# EAGLE design remote control (EAGLE 8.0.0)
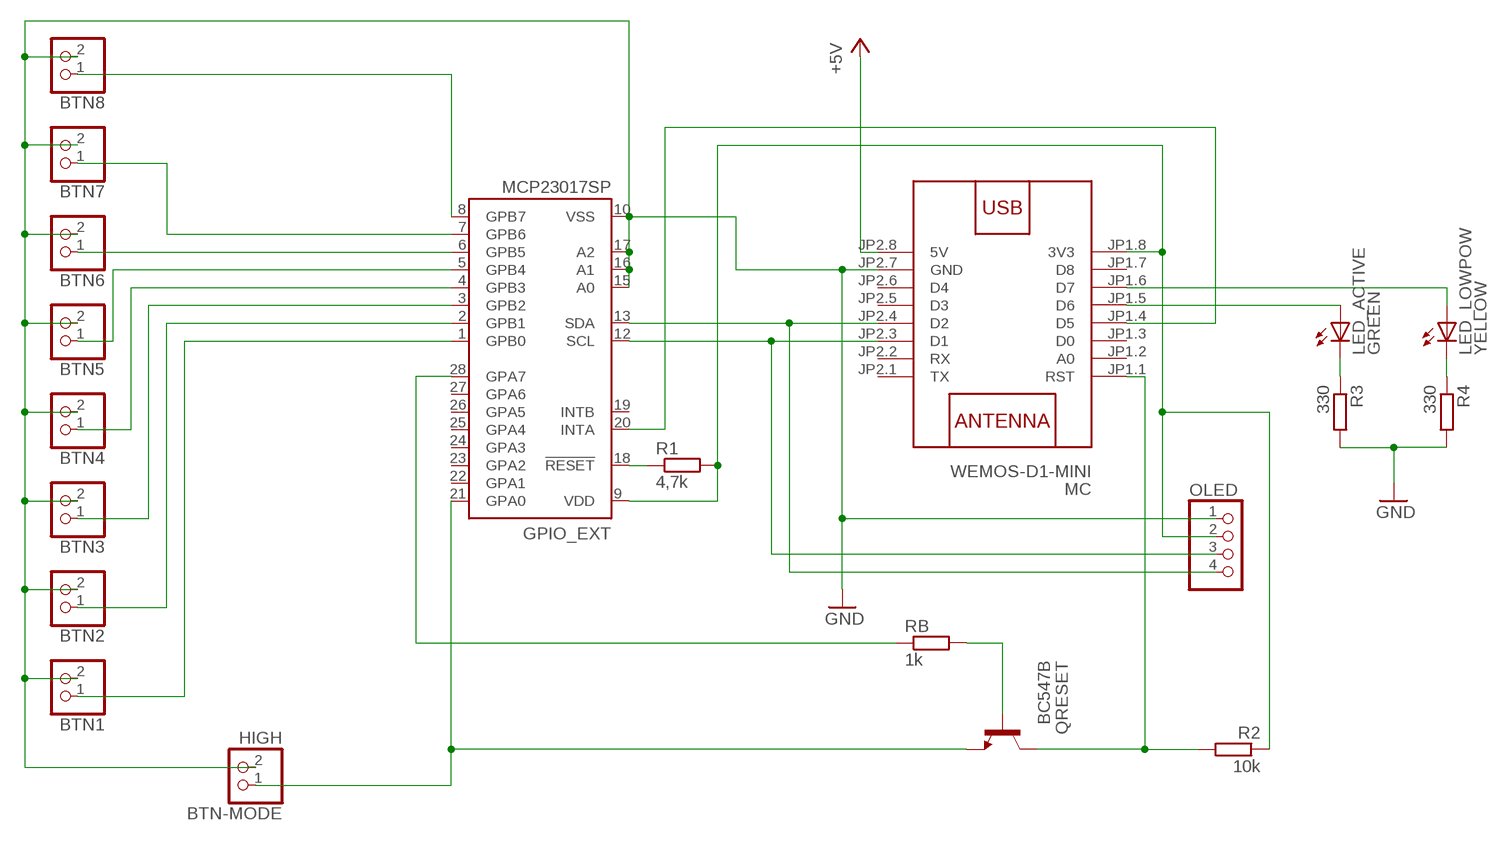
[diagram p0: schematic, sheet 1]

## Parts
BTN1  HIGH  PINHD-1X2  [1X02]
BTN2  HIGH  PINHD-1X2  [1X02]
BTN3  PINHD-1X2  [1X02]
BTN4  PINHD-1X2  [1X02]
BTN5  PINHD-1X2  [1X02]
BTN6  PINHD-1X2  [1X02]
BTN7  PINHD-1X2  [1X02]
BTN8  PINHD-1X2  [1X02]
BTN-MODE  HIGH  PINHD-1X2  [1X02]
GPIO_EXT  MCP23017SP  [DIL28-3]
LED_ACTIVE  GREEN  LED3MM  [LED3MM]
LED_LOWPOW  YELLOW  LED3MM  [LED3MM]
MC  WEMOS-D1-MINI  [WEMOS-D1-MINI]
OLED  PINHD-1X4  [1X04]
QRESET  BC547B  [TO92]
R1  4,7k  R-EU_0204/5  [0204/5]
R2  10k  R-EU_0204/5  [0204/5]
R3  330  R-EU_0204/5  [0204/5]
R4  330  R-EU_0204/5  [0204/5]
RB  1k  R-EU_0204/5  [0204/5]

## Nets
+5V: MC.JP2.8(5V)
GND: BTN1.2 BTN2.2 BTN3.2 BTN4.2 BTN5.2 BTN6.2 BTN7.2 BTN8.2 BTN-MODE.2 GPIO_EXT.10(VSS) GPIO_EXT.15(A0) GPIO_EXT.16(A1) GPIO_EXT.17(A2) MC.JP2.7(GND) OLED.1 R3.2 R4.2
N$1: BTN-MODE.1 GPIO_EXT.21(GPA0) QRESET.1(E)
N$2: GPIO_EXT.20(INTA) MC.JP1.4(D5)
N$3: MC.JP1.1(RST) QRESET.3(C) R2.2
N$4: GPIO_EXT.28(GPA7) RB.1
N$5: QRESET.2(B) RB.2
N$6: LED_ACTIVE.A MC.JP1.5(D6)
N$7: LED_ACTIVE.K(C) R3.1
N$8: LED_LOWPOW.K(C) R4.1
N$9: LED_LOWPOW.A MC.JP1.6(D7)
PIN1: BTN1.1 GPIO_EXT.1(GPB0)
PIN2: BTN2.1 GPIO_EXT.2(GPB1)
PIN3: BTN3.1 GPIO_EXT.3(GPB2)
PIN4: BTN4.1 GPIO_EXT.4(GPB3)
PIN5: BTN5.1 GPIO_EXT.5(GPB4)
PIN6: BTN6.1 GPIO_EXT.6(GPB5)
PIN7: BTN7.1 GPIO_EXT.7(GPB6)
PIN8: BTN8.1 GPIO_EXT.8(GPB7)
RST_MCP: GPIO_EXT.18(!RESET) R1.1
SCL: GPIO_EXT.12(SCL) MC.JP2.3(D1) OLED.3
SDA: GPIO_EXT.13(SDA) MC.JP2.4(D2) OLED.4
VDD: GPIO_EXT.9(VDD) MC.JP1.8(3V3) OLED.2 R1.2 R2.1
Unconnected: GPIO_EXT.19(INTB) GPIO_EXT.22(GPA1) GPIO_EXT.23(GPA2) GPIO_EXT.24(GPA3) GPIO_EXT.25(GPA4) GPIO_EXT.26(GPA5) GPIO_EXT.27(GPA6) MC.JP1.2(A0) MC.JP1.3(D0) MC.JP1.7(D8) MC.JP2.1(TX) MC.JP2.2(RX) MC.JP2.5(D3) MC.JP2.6(D4)

## Library data of the parts
BTN1-BTN8 BTN-MODE = pinhead:PINHD-1X2: PIN HEADER
GPIO_EXT = microchip:MCP23017: http://ww1.microchip.com/downloads/en/DeviceDoc/21952a.pdf Source: http://ww1.microchip.com/downloads/en/DeviceDoc/21952a.pdf; MF: MICROCHIP; MPN: MCP23017-E/SP; OC_FARNELL: 1332088; OC_NEWARK: 31K2959
LED_ACTIVE LED_LOWPOW = led:LED: LED OSRAM: - CHIPLED LG R971, LG N971, LY N971, LG Q971, LY Q971, LO R971, LY R971 LH N974, LH R974 LS Q976, LO Q976, LY Q976 LO Q996 - Hyper CHIPLED LW Q18S LB Q993, LB Q99A, LB R99A - SideLED LS A670, LO A670, LY A670, LG A670, LP A670 LB A673, LV A673, LT A673, LW A673 LH A674 LY A675 LS A676, LA A676, LO A676, LY A676, LW A676 LS A679, LY A679, LG A679 - Hyper Micro SIDELED® LS Y876, LA Y876, LO Y876, LY Y876 LT Y87S - SmartLED LW L88C, LW L88S LB L89C, LB L89S, LG L890 LS L89K, LO L89K, LY L89K LS L896, LA L896, LO L896, LY L896 - TOPLED LS T670, LO T670, LY T670, LG T670, LP T670 LSG T670, LSP T670, LSY T670, LOP T670, LYG T670 LG T671, LOG T671, LSG T671 LB T673, LV T673, LT T673, LW T673 LH T674 LS T676, LA T676, LO T676, LY T676, LB T676, LH T676, LSB T676, LW T676 LB T67C, LV T67C, LT T67C, LS T67K, LO T67K, LY T67K, LW E67C LS E67B, LA E67B, LO E67B, LY E67B, LB E67C, LV E67C, LT E67C LW T67C LS T679, LY T679, LG T679 LS T770, LO T770, LY T770, LG T770, LP T770 LB T773, LV T773, LT T773, LW T773 LH T774 LS E675, LA E675, LY E675, LS T675 LS T776, LA T776, LO T776, LY T776, LB T776 LHGB T686 LT T68C, LB T68C - Hyper Mini TOPLED® LB M676 - Mini TOPLED Santana® LG M470 LS M47K, LO M47K, LY M47K Source: http://www.osram.convergy.de LUXEON: - LUMILED® LXK2-PW12-R00, LXK2-PW12-S00, LXK2-PW14-U00, LXK2-PW14-V00 LXK2-PM12-R00, LXK2-PM12-S00, LXK2-PM14-U00 LXK2-PE12-Q00, LXK2-PE12-R00, LXK2-PE12-S00, LXK2-PE14-T00, LXK2-PE14-U00 LXK2-PB12-K00, LXK2-PB12-L00, LXK2-PB12-M00, LXK2-PB14-N00, LXK2-PB14-P00, LXK2-PB14-Q00 LXK2-PR12-L00, LXK2-PR12-M00, LXK2-PR14-Q00, LXK2-PR14-R00 LXK2-PD12-Q00, LXK2-PD12-R00, LXK2-PD12-S00 LXK2-PH12-R00, LXK2-PH12-S00 LXK2-PL12-P00, LXK2-PL12-Q00, LXK2-PL12-R00 Source: www.luxeon.com KINGBRIGHT: KA-3528ASYC Source: www.kingbright.com
MC = diy-modules:WEMOS-D1-MINI: WEMOS D1 mini: Mini Wi-Fi Board based on ESP-8266 device More details can be found here: https://www.wemos.cc/product/d1-mini.html Click here to find device on ebay.com <http://www.ebay.com/sch/wemos+d1+mini+nodemcu>
OLED = pinhead:PINHD-1X4: PIN HEADER
QRESET = transistor-npn:BC547*: NPN Transistor
R1-R4 RB = resistor:R-EU_: RESISTOR, European symbol

## Board
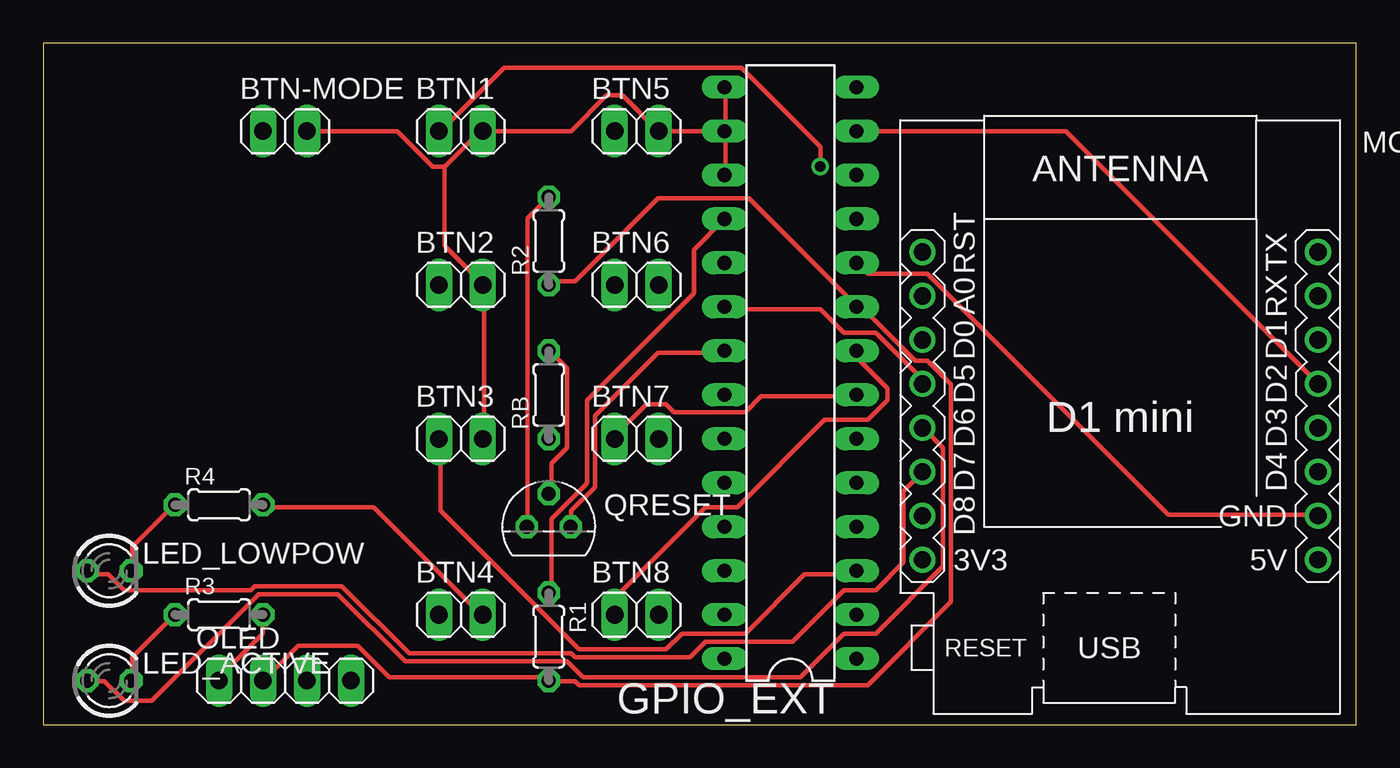
[diagram p1: board, top side]
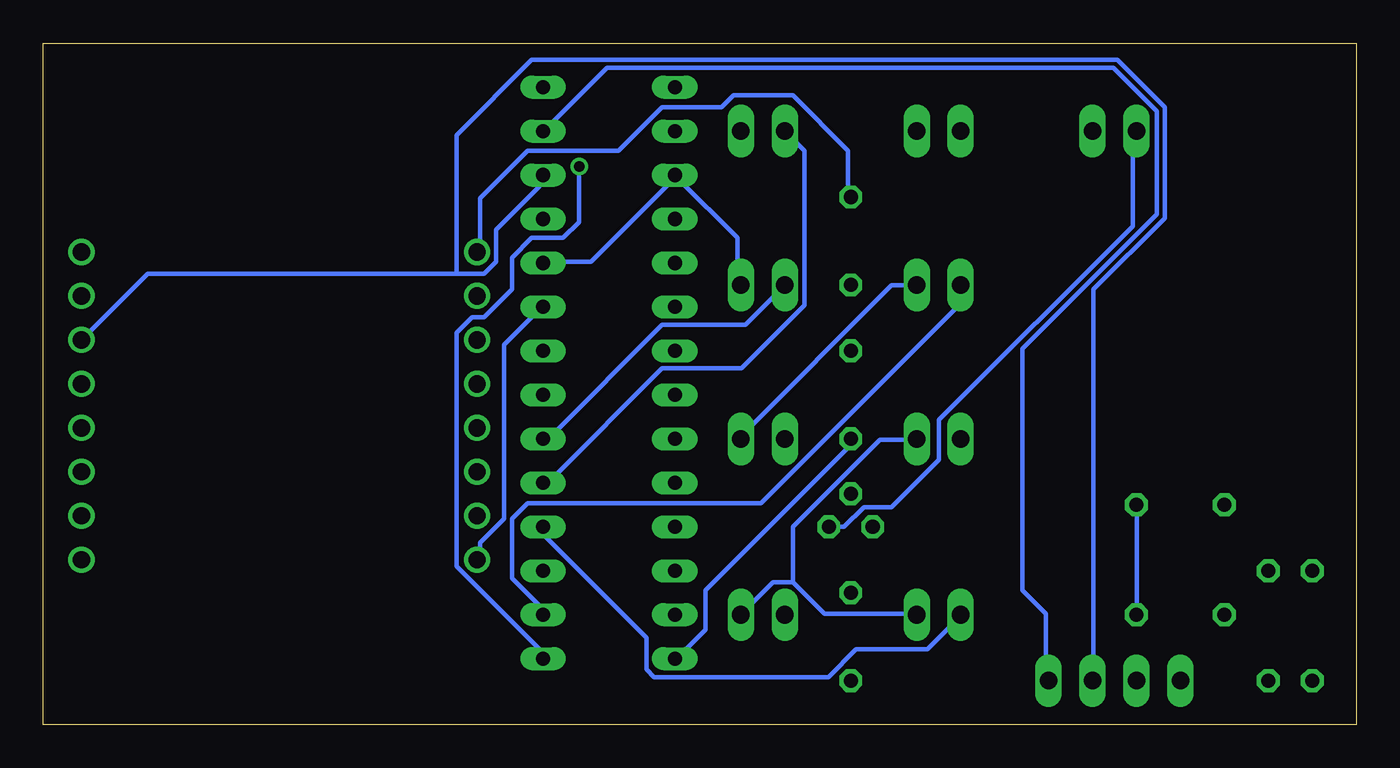
[diagram p2: board, bottom side, seen from below]

Size 75.87 x 39.36 mm. Coordinates in mm from the lower left corner, seen from the top.
Outline: 0,0 75.87,0 75.87,39.36 0,39.36 0,0
Copper layers (1*16): Top 0.035mm / dielectric 1.5mm / Bottom 0.035mm
Design rules "default": minimum track width 10mil, minimum drill 24mil, track to track 8mil, track to pad 8mil, pad to pad 8mil, via to via 8mil, smd to smd 8mil, copper to edge 40mil, drill to drill 8mil, minimum pad ring 10mil, minimum via ring 8mil, stop-mask expansion 4mil, vias tented up to drill 0mil, thermal gap 10mil

### Footprints (pad centres in the part's own frame; a part is rotated, then mirrored left to right if it is on the bottom)
1X02 = drill 1.016 long: 1 -1.27,0; 2 1.27,0
DIL28-3 = drill 0.813 long: 1 -16.51,-3.81; 2 -13.97,-3.81; 3 -11.43,-3.81; 4 -8.89,-3.81; 5 -6.35,-3.81; 6 -3.81,-3.81; 7 -1.27,-3.81; 8 1.27,-3.81; 9 3.81,-3.81; 10 6.35,-3.81; 11 8.89,-3.81; 12 11.43,-3.81; 13 13.97,-3.81; 14 16.51,-3.81; 15 16.51,3.81; 16 13.97,3.81; 17 11.43,3.81; 18 8.89,3.81; 19 6.35,3.81; 20 3.81,3.81; 21 1.27,3.81; 22 -1.27,3.81; 23 -3.81,3.81; 24 -6.35,3.81; 25 -8.89,3.81; 26 -11.43,3.81; 27 -13.97,3.81; 28 -16.51,3.81
LED3MM = drill 0.813 octagon: A -1.27,0; K 1.27,0
WEMOS-D1-MINI = drill 1: JP1.1 -11.43,9.525; JP1.2 -11.43,6.985; JP1.3 -11.43,4.445; JP1.4 -11.43,1.905; JP1.5 -11.43,-0.635; JP1.6 -11.43,-3.175; JP1.7 -11.43,-5.715; JP1.8 -11.43,-8.255; JP2.1 11.43,9.525; JP2.2 11.43,6.985; JP2.3 11.43,4.445; JP2.4 11.43,1.905; JP2.5 11.43,-0.635; JP2.6 11.43,-3.175; JP2.7 11.43,-5.715; JP2.8 11.43,-8.255
1X04 = drill 1.016 long: 1 -3.81,0; 2 -1.27,0; 3 1.27,0; 4 3.81,0
TO92 = drill 0.813 octagon: 1 1.27,0; 2 0,1.905; 3 -1.27,0
0204/5 = drill 0.813 octagon: 1 -2.54,0; 2 2.54,0

### Placement (x,y rotation side)
BTN1  24.13,34.29 0 top
BTN2  24.13,25.4 0 top
BTN3  24.13,16.51 0 top
BTN4  24.13,6.35 0 top
BTN5  34.29,34.29 0 top
BTN6  34.29,25.4 0 top
BTN7  34.29,16.51 0 top
BTN8  34.29,6.35 0 top
BTN-MODE  13.97,34.29 0 top
GPIO_EXT  43.18,20.32 90 top
LED_ACTIVE  3.81,2.54 0 top
LED_LOWPOW  3.81,8.89 0 top
MC  62.23,17.78 0 top
OLED  13.97,2.54 0 top
QRESET  29.21,11.43 0 top
R1  29.21,5.08 270 top
R2  29.21,27.94 90 top
R3  10.16,6.35 0 top
R4  10.16,12.7 0 top
RB  29.21,19.05 90 top

### Tracks (layer width: path | path; a pad name or v marks a point on that pad's centre or on a via)
GND
  Top 0.254: R3.2 12.68,6.17 12.68,5.26 10.16,2.74 OLED.1 | BTN-MODE.2 20.45,34.29 22.5,32.23 23.19,32.23 | 23.19,32.23 25.25,34.29 BTN1.2 30.5,34.29 32.56,36.35 33.48,36.35 35.53,34.29 BTN5.2 GPIO_EXT.16 39.42,34.29 | BTN3.2 25.48,16.69 25.48,25.38 BTN2.2 25.25,25.6 23.19,27.66 23.19,32.23 | R4.2 12.9,12.57 19.07,12.57 25.25,6.4 BTN4.2 | 39.42,34.29 39.42,31.77 GPIO_EXT.17 | 39.42,34.29 39.42,36.8 GPIO_EXT.15 | MC.JP2.7 73.48,12.12 65.02,12.12 51.08,26.06 47.65,26.06 47.19,26.52 GPIO_EXT.10
  Bottom 0.254: R4.2 12.68,12.57 12.68,6.4 R3.2 | 32.56,8.23 30.73,6.4 25.48,6.4 BTN4.2 | 32.56,8.23 33.71,8.23 35.53,6.4 BTN8.2 | BTN7.2 35.53,16.69 26.85,25.38 25.48,25.38 BTN2.2 | 32.56,8.23 32.56,11.43 27.53,16.46 25.48,16.46 BTN3.2 | GPIO_EXT.10 46.97,26.75 44.22,26.75 39.42,31.55 GPIO_EXT.17 39.19,31.55 35.76,28.12 35.76,25.6 BTN6.2
N$1
  Top 0.254: QRESET.1 30.5,11.43 30.5,12.34 31.88,13.72 31.88,17.83 35.53,21.49 39.19,21.49 GPIO_EXT.21
  Bottom 0.254: QRESET.1 29.59,11.43 28.45,12.57 26.85,12.57 24.11,15.32 24.11,17.6 12.9,28.8 12.9,34.29 BTN-MODE.1
N$2
  Top 0.254: GPIO_EXT.20 39.42,24 44.91,24 46.28,22.63 48.11,22.63 50.85,19.89 MC.JP1.4
N$3
  Top 0.254: R2.2 27.99,29.26 27.99,11.43 QRESET.3
  Bottom 0.254: MC.JP1.1 50.62,27.43 50.62,30.4 47.88,33.15 42.62,33.15 40.11,35.66 36.68,35.66 35.99,36.35 32.56,36.35 29.36,33.15 29.36,30.63 R2.2
N$4
  Bottom 0.254: RB.1 29.36,16.46 29.36,16 37.59,7.77 37.59,5.49 39.19,3.89 GPIO_EXT.28
N$5
  Top 0.254: QRESET.2 29.36,13.49 29.36,15.09 30.28,16 30.28,20.57 29.36,21.49 RB.2
N$6
  Top 0.254: LED_ACTIVE.A 2.62,2.52 3.53,2.52 4.67,1.37 6.27,1.37 12.45,7.54 17.02,7.54 20.9,3.66 30.28,3.66 31.19,2.74 43.76,2.74 46.28,5.26 48.11,5.26 51.99,9.14 51.99,16 50.85,17.14 MC.JP1.5
N$7
  Top 0.254: LED_ACTIVE.K 5.13,2.74 5.13,3.89 7.42,6.17 R3.1
N$8
  Top 0.254: LED_LOWPOW.K 5.13,8.91 5.13,10.29 7.42,12.57 R4.1
N$9
  Top 0.254: LED_LOWPOW.A 2.62,8.69 3.76,8.69 4.67,7.77 11.99,7.77 12.22,8 17.25,8 21.13,4.12 30.5,4.12 30.73,3.89 37.36,3.89 38.28,4.8 43.31,4.8 46.28,7.77 48.11,7.77 49.71,9.37 49.71,13.49 50.62,14.4 MC.JP1.6
PIN1  (via drill 0.61)
  Top 0.254: v44.91,32.23 44.91,33.38 40.34,37.95 26.62,37.95 22.96,34.29 BTN1.1
  Bottom 0.254: v44.91,32.23 44.91,29.03 45.82,28.12 47.65,28.12 48.79,26.98 48.79,25.15 50.39,23.55 51.08,23.55 51.99,22.63 51.99,9.14 47.19,4.34 47.19,3.89 GPIO_EXT.1
PIN2
  Bottom 0.254: GPIO_EXT.2 47.19,6.4 47.19,6.86 48.79,8.46 48.79,11.89 47.88,12.8 34.39,12.8 22.96,24.23 22.96,25.38 BTN2.1
PIN3
  Top 0.254: GPIO_EXT.3 46.97,8.69 43.99,8.69 40.56,5.26 36.91,5.26 35.99,4.34 30.96,4.34 22.96,12.34 22.96,16.46 BTN3.1
PIN4
  Bottom 0.254: GPIO_EXT.4 46.97,11.43 46.97,10.97 41.02,5.03 41.02,3.2 40.56,2.74 30.5,2.74 28.91,4.34 24.79,4.34 22.96,6.17 BTN4.1
PIN5
  Bottom 0.254: BTN5.1 31.88,33.15 31.88,24.23 35.53,20.57 40.11,20.57 46.51,14.17 46.97,14.17 GPIO_EXT.5
PIN6
  Bottom 0.254: GPIO_EXT.6 46.97,16.69 46.51,16.69 40.11,23.09 35.31,23.09 33.02,25.38 BTN6.1
PIN7
  Top 0.254: GPIO_EXT.7 46.97,18.97 41.48,18.97 40.56,18.06 36.45,18.06 35.99,18.52 34.85,18.52 33.02,16.69 BTN7.1
PIN8
  Top 0.254: BTN8.1 33.02,7.32 38.28,12.57 40.11,12.57 45.14,17.6 47.65,17.6 48.79,18.75 48.79,19.43 47.19,21.03 47.19,21.49 GPIO_EXT.8
RST_MCP
  Top 0.254: GPIO_EXT.18 37.59,27.43 37.59,24.92 31.42,18.75 31.42,13.95 29.36,11.89 29.36,7.77 R1.1
SCL
  Bottom 0.254: 51.99,26.06 69.83,26.06 MC.JP2.3 | 51.99,26.06 50.39,26.06 49.71,26.75 49.71,28.57 47.19,31.09 47.19,31.55 GPIO_EXT.12 | 51.99,26.06 51.99,34.06 47.65,38.41 13.82,38.41 11.07,35.66 11.07,29.26 15.19,25.15 15.19,2.74 OLED.3
SDA
  Top 0.254: GPIO_EXT.13 59.08,34.29 73.48,19.89 MC.JP2.4
  Bottom 0.254: OLED.4 17.93,2.74 17.93,6.4 19.3,7.77 19.3,21.72 11.53,29.49 11.53,35.43 14.05,37.95 43.31,37.95 46.97,34.29 GPIO_EXT.13
VDD
  Top 0.254: OLED.2 14.73,4.57 18.16,4.57 19.99,2.74 29.13,2.74 R1.2 29.36,2.52 30.73,2.52 30.96,2.29 47.65,2.29 52.45,7.09 52.45,19.66 51.08,21.03 50.39,21.03 47.19,24.23 GPIO_EXT.9 46.97,24.23 40.79,30.4 35.53,30.4 30.73,25.6 29.36,25.6 R2.1
  Bottom 0.254: MC.JP1.8 50.62,9.6 50.62,10.52 49.25,11.89 49.25,21.95 47.19,24 GPIO_EXT.9